# EAGLE design untitled (EAGLE 7.7.0)
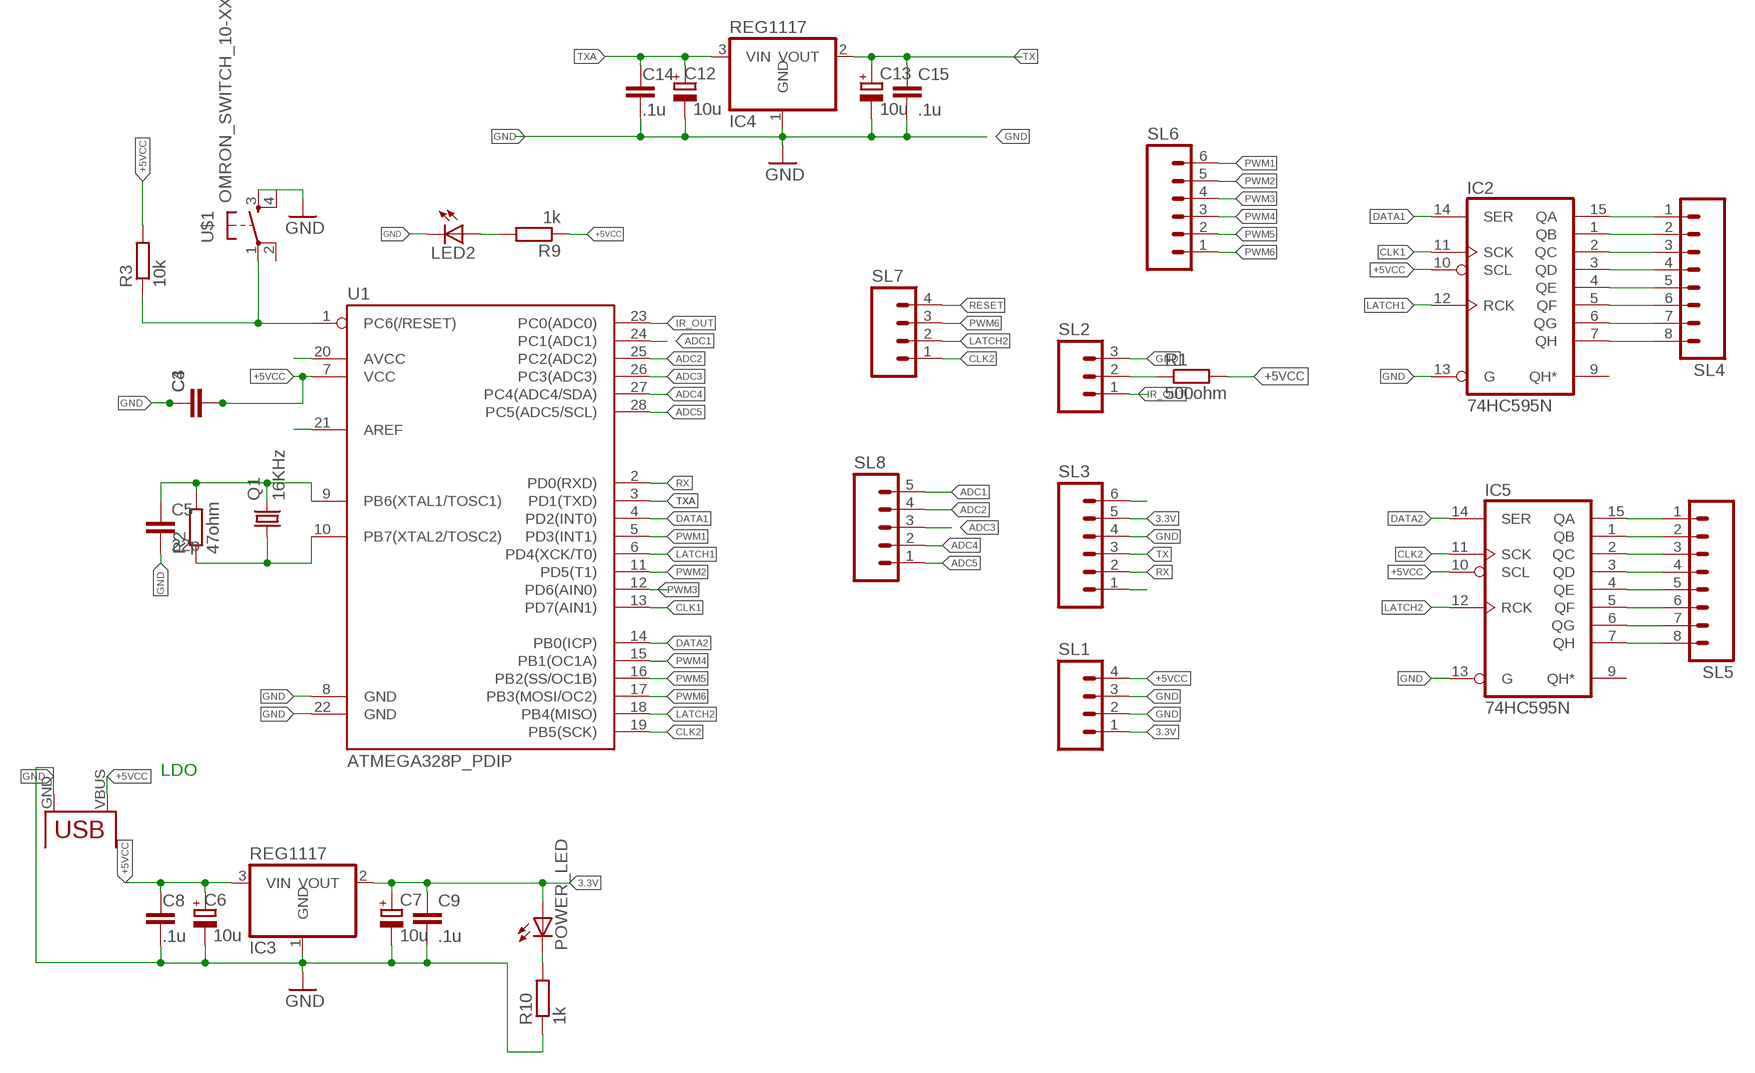
[diagram p0: schematic, sheet 1]

## Parts
C3  C-EU025-025X050  [C025-025X050]
C4  C-EU025-025X050  [C025-025X050]
C5  22p  C-EU025-025X050  [C025-025X050]
C6  10u  CPOL-EUE2.5-5  [E2,5-5]
C7  10u  CPOL-EUE2.5-5  [E2,5-5]
C8  .1u  C-EU025-025X050  [C025-025X050]
C9  .1u  C-EU025-025X050  [C025-025X050]
C12  10u  CPOL-EUE2.5-5  [E2,5-5]
C13  10u  CPOL-EUE2.5-5  [E2,5-5]
C14  .1u  C-EU025-025X050  [C025-025X050]
C15  .1u  C-EU025-025X050  [C025-025X050]
IC2  74HC595N  [DIL16]
IC3  REG1117  [SOT223]
IC4  REG1117  [SOT223]
IC5  74HC595N  [DIL16]
LED2  LED3MM  [LED3MM]
POWER_LED  LED3MM  [LED3MM]
Q1  16KHz  CRYSTALTC26H  [TC26H]
R1  500ohm  R-EU_0207/7  [0207/7]
R2  47ohm  R-EU_0207/7  [0207/7]
R3  10k  R-EU_0207/7  [0207/7]
R9  1k  R-EU_0207/10  [0207/10]
R10  1k  R-EU_0207/7  [0207/7]
SL1  M04  [04P]
SL2  M03  [03P]
SL3  M06  [06P]
SL4  M08  [08P]
SL5  M08  [08P]
SL6  M06  [06P]
SL7  M04  [04P]
SL8  M05  [05P]
U1  ATMEGA328P_PDIP  [DIL28-3]
U$1  OMRON_SWITCH_10-XX  [B3F-10XX]
U$2  USB(POWER)  [USB(POWER)]

## Nets
3.3V: C7.+ C9.1 IC3.2(VOUT) POWER_LED.A SL1.1 SL3.5
+5VCC: C3.2 C4.2 C6.+ C8.1 IC2.10(SCL) IC3.3(VIN) IC5.10(SCL) R1.2 R3.2 R9.1 SL1.4 U1.7(VCC) U$2.VBUS(VCC)
ADC1: SL8.5 U1.24(PC1(ADC1))
ADC2: SL8.4 U1.25(PC2(ADC2))
ADC3: SL8.3 U1.26(PC3(ADC3))
ADC4: SL8.2 U1.27(PC4(ADC4/SDA))
ADC5: SL8.1 U1.28(PC5(ADC5/SCL))
CLK1: IC2.11(SCK) U1.13(PD7(AIN1))
CLK2: IC5.11(SCK) SL7.1 U1.19(PB5(SCK))
DATA1: IC2.14(SER) U1.4(PD2(INT0))
DATA2: IC5.14(SER) U1.14(PB0(ICP))
GND: C3.1 C4.1 C5.2 C6.- C7.- C8.2 C9.2 C12.- C13.- C14.2 C15.2 IC2.13(G) IC3.1(GND) IC4.1(GND) IC5.13(G) LED2.K(C) R10.1 SL1.2 SL1.3 SL2.3 SL3.4 U1.8(GND) U1.22(GND) U$1.3(S) U$2.GND
IR_OUT: SL2.1 U1.23(PC0(ADC0))
LATCH1: IC2.12(RCK) U1.6(PD4(XCK/T0))
LATCH2: IC5.12(RCK) SL7.2 U1.18(PB4(MISO))
N$1: IC2.15(QA) SL4.1
N$2: R1.1 SL2.2
N$3: LED2.A R9.2
N$4: SL3.6
N$8: SL3.1
N$10: IC2.1(QB) SL4.2
N$11: C5.1 Q1.2 R2.2 U1.9(PB6(XTAL1/TOSC1))
N$25: U1.20(AVCC)
N$26: Q1.1 R2.1 U1.10(PB7(XTAL2/TOSC2))
N$27: U1.21(AREF)
N$28: POWER_LED.K(C) R10.2
N$29: IC2.3(QD) SL4.4
N$30: IC2.2(QC) SL4.3
N$31: IC2.4(QE) SL4.5
N$32: IC2.5(QF) SL4.6
N$33: IC2.6(QG) SL4.7
N$34: IC2.7(QH) SL4.8
N$36: IC5.15(QA) SL5.1
N$37: IC5.1(QB) SL5.2
N$38: IC5.2(QC) SL5.3
N$39: IC5.3(QD) SL5.4
N$40: IC5.4(QE) SL5.5
N$41: IC5.5(QF) SL5.6
N$42: IC5.6(QG) SL5.7
N$43: IC5.7(QH) SL5.8
PWM1: SL6.6 U1.5(PD3(INT1))
PWM2: SL6.5 U1.11(PD5(T1))
PWM3: SL6.4 U1.12(PD6(AIN0))
PWM4: SL6.3 U1.15(PB1(OC1A))
PWM5: SL6.2 U1.16(PB2(SS/OC1B))
PWM6: SL6.1 SL7.3 U1.17(PB3(MOSI/OC2))
RESET: R3.1 SL7.4 U1.1(PC6(/RESET)) U$1.1(P)
RX: SL3.2 U1.2(PD0(RXD))
TX: C13.+ C15.1 IC4.2(VOUT) SL3.3
TXA: C12.+ C14.1 IC4.3(VIN) U1.3(PD1(TXD))
Unconnected: IC2.9(QH*) IC5.9(QH*) U$1.2(P1) U$1.4(S1)

## Notes on the sheet
- LDO

## Power pins joined to a net without a drawn wire
GND: IC2.8(GND) IC5.8(GND)
VCC: IC2.16(VCC) IC5.16(VCC)

## Library data of the parts
C3 C4 = cpoAkshat:C-EU: CAPACITOR, European symbol
C5 = rcl:C-EU: CAPACITOR, European symbol
C6 C7 C12 C13 = cpo_sdjhjasjhasjf:CPOL-EU: POLARIZED CAPACITOR, European symbol
C8 C9 C14 C15 = cpo_sdjhjasjhasjf:C-EU: CAPACITOR, European symbol
IC2 IC5 = 74xx-eu:74*595: 8-bit SHIFT REGISTER, output latch
IC3 IC4 = CEDT_JANUARY_2015_v5:REG1117: 800mA and 1A Low Dropout (LDO) Positive Regulator 1.8V, 2.5V, 2.85V, 3.3V, 5V, and Adj
LED2 POWER_LED = CEDT_JANUARY_2015_v5:LED
Q1 = CEDT_JANUARY_2015_v5:CRYSTAL: Crystals Various standard crystals. Proven footprints. Spark Fun Electronics SKU : COM-00534
R1-R3 = cpoAkshat:R-EU_: RESISTOR, European symbol
R9 R10 = resistor:R-EU_: RESISTOR, European symbol
SL1 SL7 = con-amp-quick:M04: AMP QUICK CONNECTOR; OC_FARNELL: unknown; OC_NEWARK: unknown
SL2 = con-amp-quick:M03: AMP QUICK CONNECTOR; OC_FARNELL: unknown; OC_NEWARK: unknown
SL3 SL6 = con-amp-quick:M06: AMP QUICK CONNECTOR; OC_FARNELL: unknown; OC_NEWARK: unknown
SL4 SL5 = con-amp-quick:M08: AMP QUICK CONNECTOR; OC_FARNELL: unknown; OC_NEWARK: unknown
SL8 = con-amp-quick:M05: AMP QUICK CONNECTOR; OC_FARNELL: unknown; OC_NEWARK: unknown
U1 = SparkFun-DigitalIC:ATMEGA328P_PDIP: uC used in the Arduino 32kb flash, 1k EEPROM, 2k SRAM This is the through-hole version of this chip.
U$1 = CEDT_JANUARY_2015_v5:OMRON_SWITCH
U$2 = CEDT_JANUARY_2015_v5:USB(POWER)

## Board
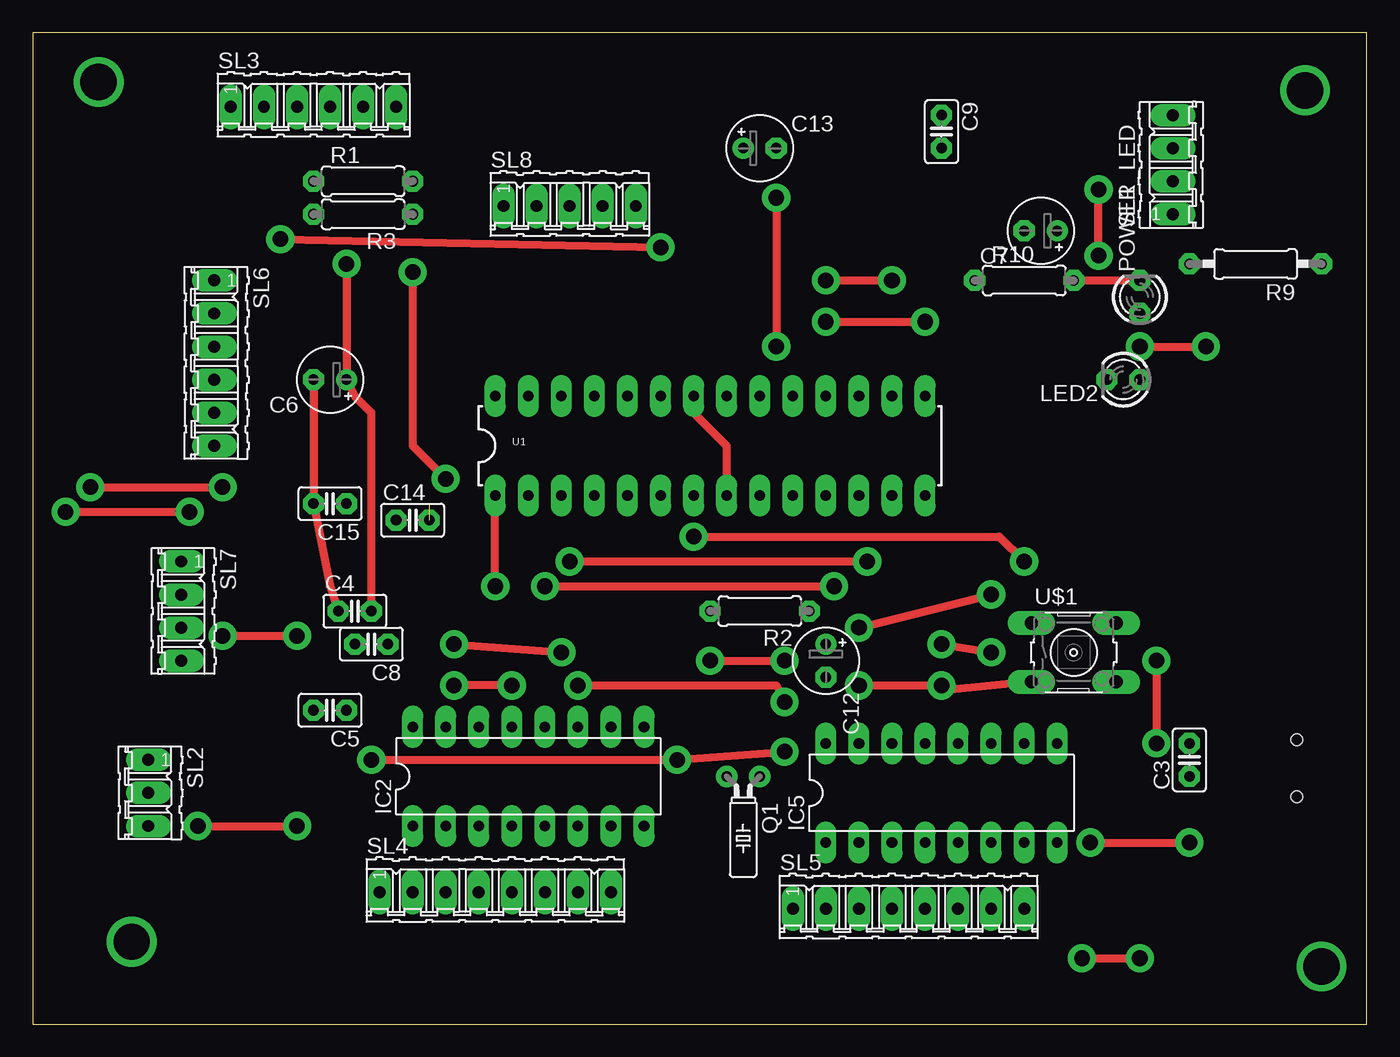
[diagram p1: board, top side]
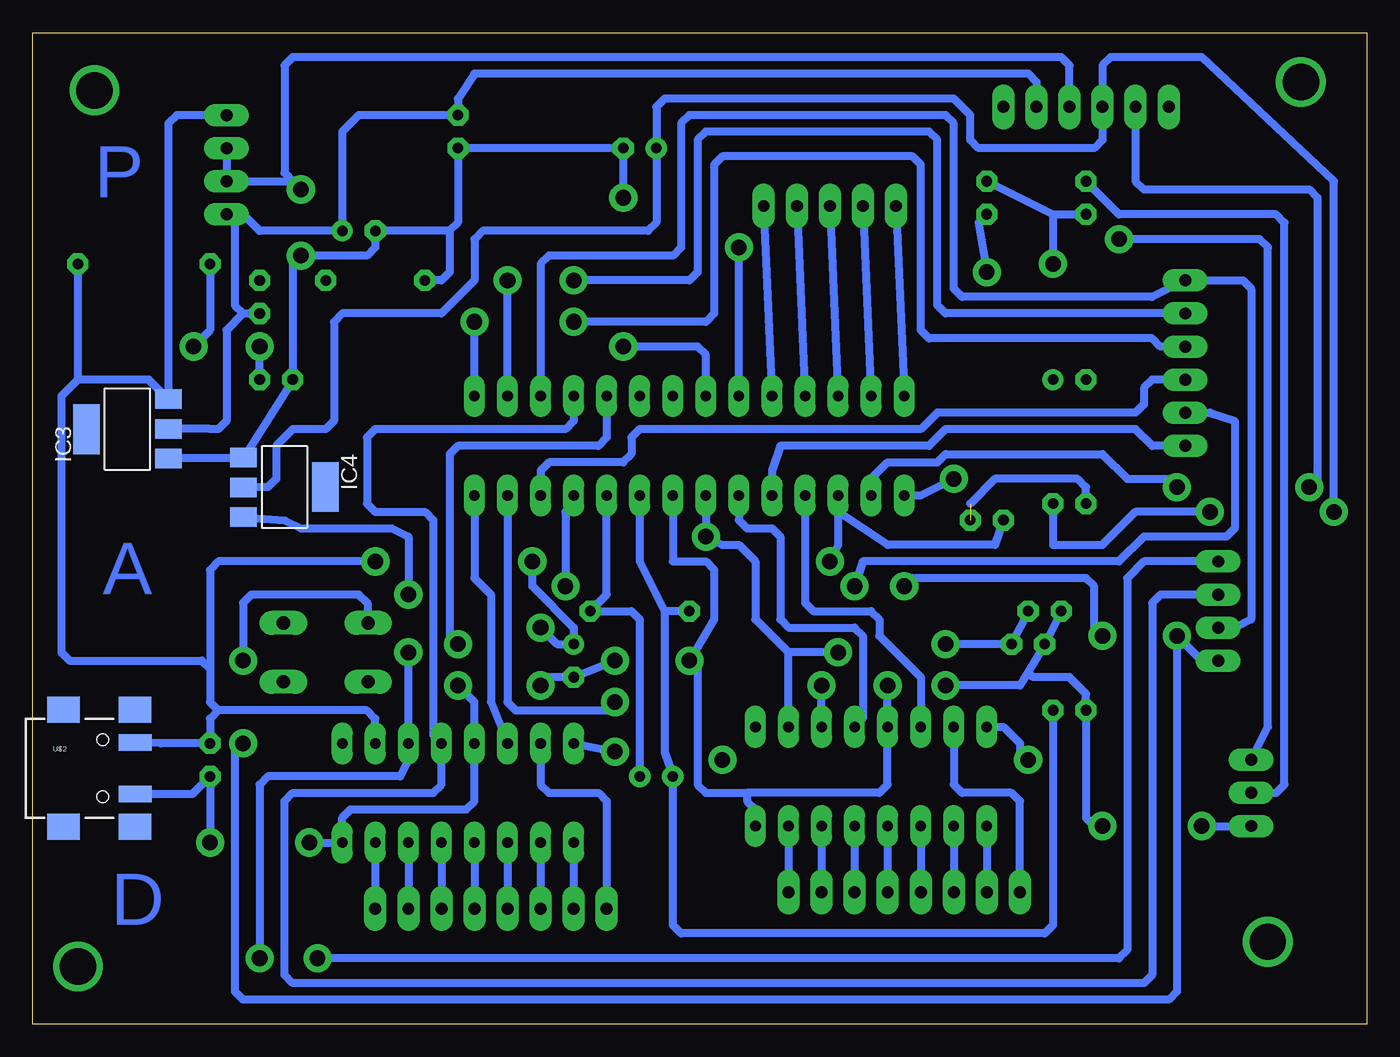
[diagram p2: board, bottom side, seen from below]

Size 102.54 x 76.19 mm. Coordinates in mm from the lower left corner, seen from the top.
Outline: 0,0 102.54,0 102.54,76.19 0,76.19 0,0
Copper layers (1*16): Top 0.035mm / dielectric 1.5mm / Bottom 0.035mm
Design rules "default *": minimum track width 16mil, minimum drill 24mil, track to track 16mil, track to pad 16mil, pad to pad 16mil, via to via 16mil, smd to smd 8mil, copper to edge 40mil, drill to drill 8mil, minimum pad ring 16mil, minimum via ring 16mil, stop-mask expansion 4mil, vias tented up to drill 0mil, thermal gap 10mil

### Footprints (pad centres in the part's own frame; a part is rotated, then mirrored left to right if it is on the bottom)
C025-025X050 = drill 0.813 octagon: 1 -1.27,0; 2 1.27,0
E2,5-5 = drill 0.813 pad 1.6: + -1.27,0 | drill 0.813 pad 1.6 octagon: - 1.27,0
DIL16 = drill 0.813 long: 1 -8.89,-3.81; 2 -6.35,-3.81; 3 -3.81,-3.81; 4 -1.27,-3.81; 5 1.27,-3.81; 6 3.81,-3.81; 7 6.35,-3.81; 8 8.89,-3.81; 9 8.89,3.81; 10 6.35,3.81; 11 3.81,3.81; 12 1.27,3.81; 13 -1.27,3.81; 14 -3.81,3.81; 15 -6.35,3.81; 16 -8.89,3.81
SOT223 = smd 1.499 x 2.007: 1 -2.261,-3.15; 2 0.025,-3.15; 3 2.311,-3.15 | smd 3.81 x 2.007: 4 0,3.15
LED3MM = drill 0.813 octagon: A -1.27,0; K 1.27,0
TC26H = drill 0.813 pad 1.676: 1 -1.27,0; 2 1.27,0
0207/7 = drill 0.813 octagon: 1 -3.81,0; 2 3.81,0
0207/10 = drill 0.813 octagon: 1 -5.08,0; 2 5.08,0
04P = drill 0.914 long: 1 -3.81,0; 2 -1.27,0; 3 1.27,0; 4 3.81,0
03P = drill 0.914 long: 1 -2.54,0; 2 0,0; 3 2.54,0
06P = drill 0.914 long: 1 -6.35,0; 2 -3.81,0; 3 -1.27,0; 4 1.27,0; 5 3.81,0; 6 6.35,0
08P = drill 0.914 long: 1 -8.89,0; 2 -6.35,0; 3 -3.81,0; 4 -1.27,0; 5 1.27,0; 6 3.81,0; 7 6.35,0; 8 8.89,0
05P = drill 0.914 long: 1 -5.08,0; 2 -2.54,0; 3 0,0; 4 2.54,0; 5 5.08,0
DIL28-3 = drill 0.813 long: 1 -16.51,-3.81; 2 -13.97,-3.81; 3 -11.43,-3.81; 4 -8.89,-3.81; 5 -6.35,-3.81; 6 -3.81,-3.81; 7 -1.27,-3.81; 8 1.27,-3.81; 9 3.81,-3.81; 10 6.35,-3.81; 11 8.89,-3.81; 12 11.43,-3.81; 13 13.97,-3.81; 14 16.51,-3.81; 15 16.51,3.81; 16 13.97,3.81; 17 11.43,3.81; 18 8.89,3.81; 19 6.35,3.81; 20 3.81,3.81; 21 1.27,3.81; 22 -1.27,3.81; 23 -3.81,3.81; 24 -6.35,3.81; 25 -8.89,3.81; 26 -11.43,3.81; 27 -13.97,3.81; 28 -16.51,3.81
B3F-10XX = drill 1.016 long: 1 -3.251,2.261; 2 3.251,2.261; 3 -3.251,-2.261; 4 3.251,-2.261
USB(POWER) = smd 2.54 x 1.27: GND 2.5,-1.981; VBUS 2.5,1.981 | smd 2.5 x 2: GND@1 -3,-4.5; GND@2 -3,4.5; GND@3 2.5,4.5; GND@4 2.5,-4.5 | hole 0.9: 0,2.2; 0,-2.2

### Placement (x,y rotation side)
C3  88.9,20.32 90 top
C4  24.77,31.75 0 top
C5  22.86,24.13 180 top
C6  22.86,49.53 180 top
C7  77.47,60.96 180 top
C8  26.03,29.21 180 top
C9  69.85,68.58 270 top
C12  60.96,27.94 270 top
C13  55.88,67.31 0 top
C14  29.21,38.74 0 top
C15  22.86,40.01 180 top
IC2  38.1,19.05 0 top
IC3  95.25,45.72 90 bottom
IC4  83.19,41.28 270 bottom
IC5  69.85,17.78 0 top
LED2  83.82,49.53 180 top
POWER_LED  85.09,55.88 90 top
Q1  54.61,19.05 180 top
R1  25.4,64.77 0 top
R2  55.88,31.75 180 top
R3  25.4,62.23 180 top
R9  93.98,58.42 180 top
R10  76.2,57.15 0 top
SL1  87.63,66.04 90 top
SL2  8.89,17.78 270 top
SL3  21.59,70.48 0 top
SL4  35.56,10.16 0 top
SL5  67.31,8.89 0 top
SL6  13.97,50.8 270 top
SL7  11.43,31.75 270 top
SL8  41.27,62.87 0 top
U1  52.07,44.45 0 top
U$1  80.01,28.57 0 top
U$2  97.16,19.68 0 bottom

### Tracks (layer width: path | path; a pad name or v marks a point on that pad's centre or on a via)
3.3V
  Bottom 0.61: 86.36,54.61 87,55.25 87,61.6 SL1.1 86.36,62.23 85.09,60.96 C7.+ 78.74,68.58 77.47,69.85 C9.1 69.85,71.12 68.58,73.02 26.03,73.02 25.4,72.39 SL3.5 | 86.36,54.61 POWER_LED.A | 86.36,54.61 87.63,53.34 87.63,46.36 88.27,45.72 88.9,45.72 88.92,45.75 IC3.2
+5VCC  (via drill 1.2)
  Top 0.61: v24.13,58.42 C6.+ 24.77,48.26 26.03,46.99 C4.2 | v32.38,29.21 v40.64,28.57 | v50.8,37.47 74.3,37.47 v76.2,35.56
  Bottom 0.61: SL1.4 91.44,69.85 92.1,69.19 IC3.3 93.6,49.53 99.06,49.53 | 99.06,49.53 100.33,48.26 100.33,28.57 99.69,27.94 89.53,27.94 88.9,27.3 | R9.1 99.06,49.53 | IC5.10 76.2,23.5 76.83,24.13 88.27,24.13 | 88.27,24.13 88.9,23.5 C3.2 92.67,21.59 U$2.VBUS | R1.2 24.13,62.23 | 24.13,62.23 R3.2 | C4.2 C8.1 v32.38,29.21 | 24.13,62.23 v24.13,58.42 24.13,59.05 | IC2.10 44.45,28.57 | 44.45,28.57 46.99,31.11 46.99,35.56 48.26,36.83 49.53,36.83 v50.8,37.47 U1.7 | v40.64,28.57 44.45,28.57 | v76.2,35.56 88.27,35.56 88.9,34.93 88.9,27.3 | 88.9,27.3 88.9,24.77 88.27,24.13
ADC1
  Bottom 0.61: SL8.5 U1.24
ADC2
  Bottom 0.61: SL8.4 U1.25
ADC3
  Bottom 0.61: SL8.3 U1.26
ADC4
  Bottom 0.61: SL8.2 U1.27
ADC5
  Bottom 0.61: SL8.1 U1.28
CLK1  (via drill 1.2)
  Top 0.61: v41.91,26.04 57.15,26.04 v57.78,24.77
  Bottom 0.61: U1.13 66.04,24.77 65.41,24.13 58.42,24.13 v57.78,24.77 | IC2.11 v41.91,26.04
CLK2  (via drill 1.2, 1.2 pad 1.93)
  Top 0.61: v69.85,29.21 v73.66,28.57 | v80.64,5.08 v85.09,5.08
  Bottom 0.61: U1.19 58.42,45.09 59.05,44.45 69.85,44.45 70.48,43.82 70.48,29.21 v69.85,29.21 | v73.66,28.57 IC5.11 73.66,20.32 74.3,19.05 84.45,19.05 85.09,18.41 v85.09,5.08 | v80.64,5.08 19.05,5.08 18.41,5.71 18.41,34.29 17.14,35.56 SL7.1
DATA1
  Bottom 0.61: U1.4 43.18,32.38 42.55,31.75 38.1,31.75 37.46,31.11 37.46,29.84 34.29,26.67 IC2.14
DATA2
  Bottom 0.61: U1.14 68.58,34.29 67.31,33.02 67.31,24.77 IC5.14
GND  (via drill 1.2, 1.2 pad 1.93)  (1 unrouted)
  Top 0.61: U$1.3 70.13,25.68 v69.85,26.04 v63.5,26.04 | v36.83,26.04 v32.38,26.04 | v57.15,63.5 v57.15,52.07 | v12.7,15.24 v20.32,15.24 | v81.28,13.97 v88.9,13.97 | v81.91,59.05 v81.91,64.14 | v52.07,27.94 v57.78,27.94 | C4.1 22.86,33.66 C15.2 C6.- | U1.22 50.8,46.99 53.34,44.45 U1.8
  Bottom 0.61: 70.48,60.96 69.85,61.6 C9.2 C13.- v57.15,63.5 | 70.48,60.96 C7.- 76.2,59.69 76.83,59.05 v81.91,59.05 82.55,58.42 LED2.K 82.52,49.51 IC4.1 92.02,43.54 IC3.1 | 88.9,14.61 v88.9,13.97 | 88.9,14.61 C3.1 90.25,17.7 U$2.GND | 88.9,14.61 88.27,13.97 | v81.28,13.97 IC5.8 78.74,15.88 78.11,16.51 69.22,16.51 68.58,17.14 IC5.13 68.58,24.77 v69.85,26.04 | v20.32,15.24 20.95,15.24 21.59,15.88 C5.2 21.59,25.4 22.86,26.67 25.66,26.67 26.05,27.06 | v12.7,15.24 SL2.3 | v57.78,27.94 C12.- 62.86,26.67 v63.5,26.04 | 47.62,17.78 50.8,17.78 51.43,18.41 51.43,27.3 v52.07,27.94 50.16,31.11 50.16,34.93 50.8,35.56 53.34,35.56 U1.8 | 70.48,60.96 70.48,57.79 71.12,57.15 R10.1 | C4.1 C8.2 26.05,27.06 | 26.05,27.06 26.67,26.04 v32.38,26.04 | 47.62,17.78 37.46,17.78 36.83,18.41 IC2.13 v36.83,26.04 | 47.62,17.78 47.62,17.14 46.99,16.51 IC2.8 | U1.22 50.8,51.44 51.43,52.07 v57.15,52.07 | SL1.3 SL1.2 82.55,64.77 | 82.55,64.77 v81.91,64.14 | SL3.4 22.86,73.66 23.49,74.3 82.55,74.3 83.19,73.66 83.19,65.41 82.55,64.77 | C15.2 21.59,41.28 22.23,41.91 28.58,41.91 30.48,40.01
IR_OUT  (via drill 1.2)
  Top 0.61: v19.05,60.33 v48.26,59.69
  Bottom 0.61: SL2.1 7.62,22.86 7.62,59.69 8.25,60.33 v19.05,60.33 | U1.23 v48.26,59.69
LATCH1
  Bottom 0.61: IC2.12 38.73,23.5 38.73,29.84 39.37,30.48 44.45,30.48 45.09,31.11 45.09,37.47 45.72,38.1 47.62,38.1 48.26,38.74 U1.6
LATCH2
  Bottom 0.61: U1.18 60.96,46.36 61.59,45.72 76.2,45.72 76.83,45.09 76.83,40.01 76.2,39.37 72.39,39.37 71.75,38.74 71.75,22.22 IC5.12 71.12,18.41 71.75,17.78 82.55,17.78 83.19,17.14 83.19,3.81 82.55,3.17 17.14,3.17 16.51,3.81 16.51,32.38 15.88,33.02 SL7.2
N$1
  Bottom 0.61: IC2.15 31.75,18.41 31.12,17.78 27.3,17.78 26.67,17.14 SL4.1
N$2
  Bottom 0.61: SL2.2 6.99,17.78 6.35,18.41 6.35,61.6 6.99,62.23 19.05,62.23 R1.1
N$3  (via drill 1.2)
  Top 0.61: v85.09,52.07 v90.17,52.07
  Bottom 0.61: LED2.A v85.09,52.07 | R9.2 88.9,53.34 v90.17,52.07
N$6  (via drill 2.8)
  other vias: 5.08,72.39
N$10
  Bottom 0.61: IC2.1 SL4.2
N$11
  Bottom 0.61: C5.1 24.13,7.62 24.77,6.98 52.7,6.98 53.34,7.62 Q1.2 53.98,20.95 53.98,31.75 | R2.2 53.98,31.75 | U1.9 55.88,35.56 53.98,31.75
N$12  (via drill 2.8)
  other vias: 97.79,71.75
N$13  (via drill 2.8)
  other vias: 99.06,4.45
N$14  (via drill 2.8)
  other vias: 7.62,6.35
N$26
  Bottom 0.61: Q1.1 55.88,31.11 56.52,31.75 R2.1 58.42,33.02 U1.10
N$28
  Top 0.61: R10.2 POWER_LED.K
N$29
  Bottom 0.61: IC2.3 SL4.4
N$30
  Bottom 0.61: IC2.2 SL4.3
N$31
  Bottom 0.61: IC2.4 SL4.5
N$32
  Bottom 0.61: IC2.5 SL4.6
N$33
  Bottom 0.61: IC2.6 SL4.7
N$34
  Bottom 0.61: IC2.7 SL4.8
N$36
  Bottom 0.61: IC5.15 63.5,18.41 62.86,17.78 59.05,17.78 58.42,17.14 SL5.1
N$37
  Bottom 0.61: IC5.1 SL5.2
N$38
  Bottom 0.61: IC5.2 SL5.3
N$39
  Bottom 0.61: IC5.3 SL5.4
N$40
  Bottom 0.61: IC5.4 SL5.5
N$41
  Bottom 0.61: IC5.5 SL5.6
N$42
  Bottom 0.61: IC5.6 SL5.7
N$43
  Bottom 0.61: IC5.7 SL5.8
PWM1
  Bottom 0.61: U1.5 45.72,42.55 45.09,44.45 33.66,44.45 32.38,45.72 17.78,45.72 16.51,44.45 SL6.6
PWM2  (via drill 1.2)
  Top 0.61: v39.37,33.66 v61.59,33.66
  Bottom 0.61: SL6.5 12.07,46.99 10.16,46.36 10.16,38.1 10.79,37.47 17.14,37.47 19.05,35.56 38.73,35.56 v39.37,33.66 | U1.11 60.96,40.01 61.59,39.37 v61.59,33.66
PWM3
  Bottom 0.61: SL6.4 16.51,49.53 17.14,48.9 17.14,47.62 17.78,46.99 33.02,46.99 34.29,45.72 55.88,45.72 56.52,45.09 56.52,43.82 57.15,43.18 62.86,43.18 63.5,42.55 U1.12
PWM4  (via drill 1.2 pad 1.93)
  Top 0.61: v60.96,53.98 v68.58,53.98
  Bottom 0.61: SL6.3 15.88,52.07 16.51,52.71 33.66,52.71 34.29,53.34 34.29,66.04 34.92,66.67 49.53,66.67 50.16,66.04 50.16,54.61 50.8,53.98 v60.96,53.98 | U1.15 v68.58,53.98
PWM5  (via drill 1.2 pad 1.93)
  Top 0.61: v60.96,57.15 v66.04,57.15
  Bottom 0.61: SL6.2 32.38,54.61 33.02,55.25 33.02,67.94 33.66,68.58 50.8,68.58 51.43,67.94 51.43,57.79 52.07,57.15 v60.96,57.15 | U1.16 v66.04,57.15
PWM6
  Bottom 0.61: SL7.3 10.16,30.48 8.89,31.11 8.89,56.52 9.53,57.15 SL6.1 16.51,55.88 31.12,55.88 31.75,56.52 31.75,69.21 32.38,69.85 52.07,69.85 52.7,69.21 52.7,59.69 53.34,59.05 62.86,59.05 63.5,58.42 U1.17
RESET  (via drill 1.2)
  Top 0.61: v86.36,27.94 v86.36,21.59 | v14.61,29.84 v20.32,29.84 | v35.56,33.66 U1.1 | v29.21,57.79 29.21,44.45 v31.75,41.91
  Bottom 0.61: SL7.4 12.7,27.94 v14.61,29.84 14.61,2.54 15.24,1.91 86.36,1.91 87,2.54 87,20.95 v86.36,21.59 | U$1.1 76.76,32.31 77.47,33.02 85.72,33.02 86.36,32.38 v86.36,27.94 | v20.32,29.84 20.95,30.48 20.95,33.66 21.59,34.29 34.92,34.29 v35.56,33.66 | R3.1 29.84,61.6 v29.21,57.79 | U1.1 34.29,40.64 v31.75,41.91
RX  (via drill 1.2)
  Top 0.61: v4.45,41.28 v14.61,41.28
  Bottom 0.61: SL3.2 17.78,64.77 17.14,64.14 4.45,64.14 3.81,63.5 3.81,41.91 v4.45,41.28 | U1.2 38.1,41.91 36.83,43.18 33.02,43.18 32.38,43.82 20.32,43.82 18.41,41.91 15.24,41.91 v14.61,41.28
TX  (via drill 1.2)
  Top 0.61: v2.54,39.37 v12.07,39.37
  Bottom 0.61: IC4.2 86.31,41.28 84.45,41.28 83.82,41.91 83.82,44.45 82.55,45.72 80.01,45.72 79.38,46.36 79.38,53.98 78.74,54.61 71.12,54.61 68.58,57.15 68.58,60.33 67.95,60.96 55.24,60.96 54.61,61.6 C13.+ 54.61,70.48 53.98,71.12 31.75,71.12 30.48,69.85 30.48,67.94 29.84,67.31 20.95,67.31 20.32,67.94 SL3.3 20.32,73.66 19.69,74.3 12.7,74.3 2.54,64.77 v2.54,39.37 | C15.1 24.13,36.83 20.32,36.83 17.78,39.37 v12.07,39.37
TXA  (via drill 1.2, 1.2 pad 1.93)
  Top 0.61: v63.5,30.48 v73.66,33.02 | v41.27,35.56 v64.14,35.56
  Bottom 0.61: v73.66,33.02 73.66,37.47 74.93,38.1 81.91,38.1 83.16,38.71 IC4.3 | C14.1 28.58,36.83 36.83,36.83 40.64,39.37 | 40.64,39.37 U1.3 | 40.64,39.37 40.64,36.83 v41.27,35.56 | v64.14,35.56 64.14,33.66 60.96,30.48 C12.+ 62.23,29.21 v63.5,30.48
VCC  (via drill 1.2 pad 1.93)
  Top 0.61: v57.78,20.95 v49.53,20.32 v26.03,20.32
  Bottom 0.61: IC5.16 v57.78,20.95 | IC2.16 27.94,22.86 26.67,21.59 26.67,20.95 v26.03,20.32

### Text on the board
Bottom: P | A | D